# Altium schematic sheet MSP430F149.SCHDOC
size A4; Organization: UNSW Solar Racing Team; Address3: UNSW; Address4: Sydney NSW 2052; Address2: Electrical Engineering; Address1: Rm 109
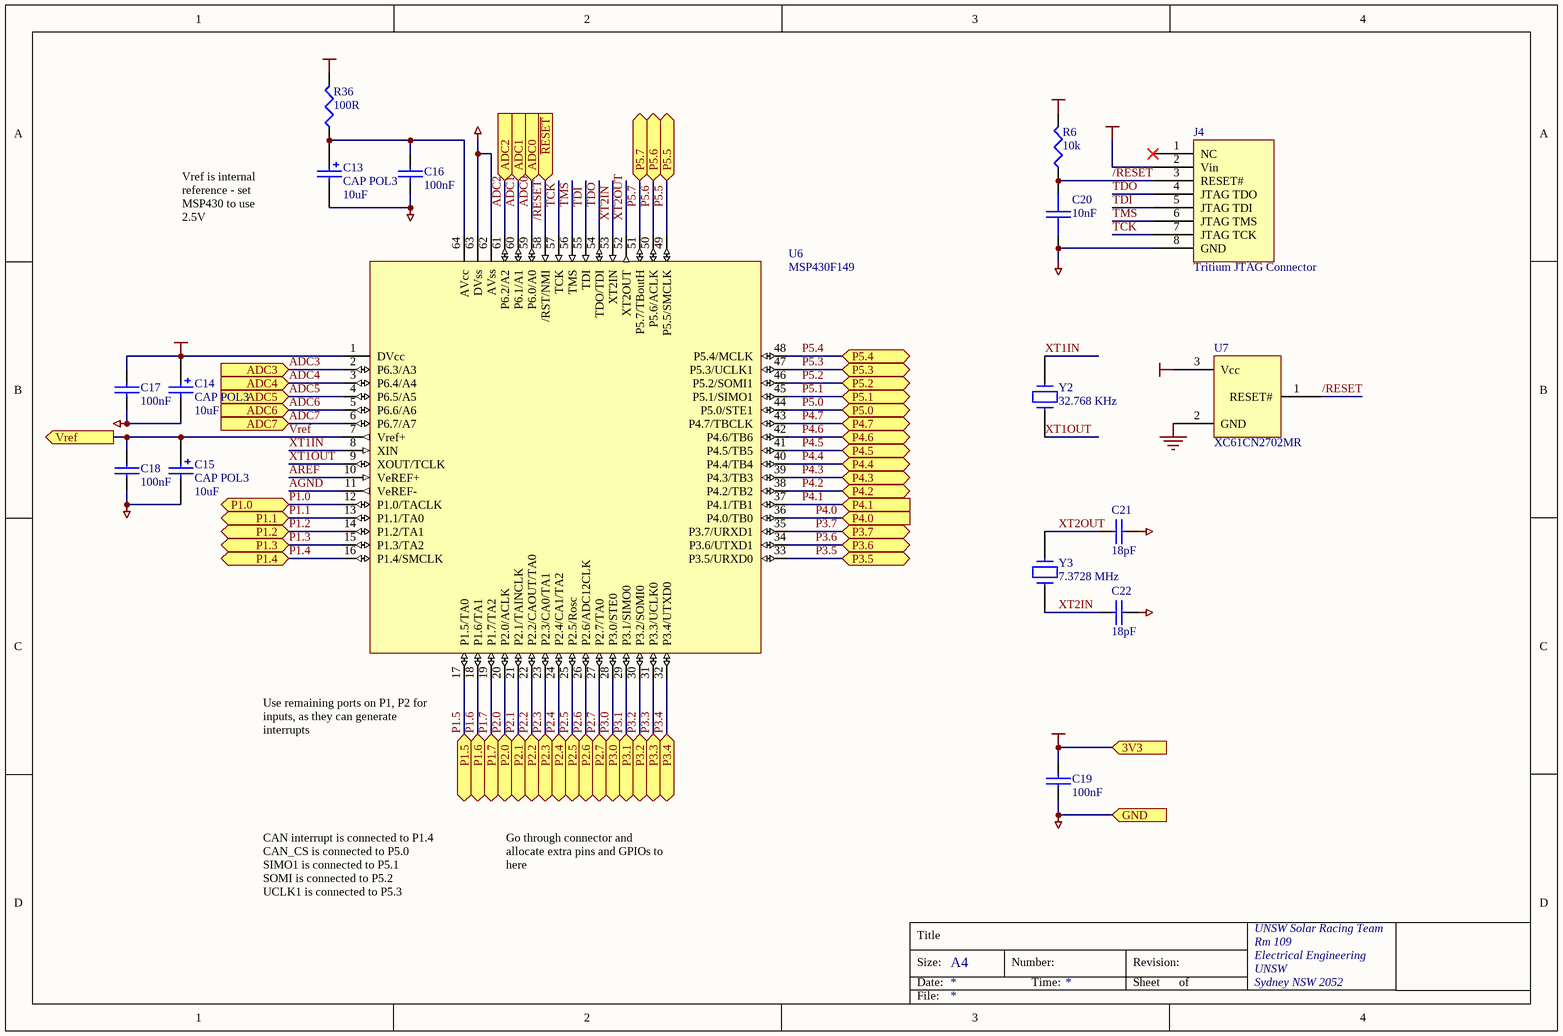
[diagram p0: MSP430F149.SCHDOC]

## Parts
C13  CAP POL3  value 10uF  [MCCT-CASEA]
C14  CAP POL3  value 10uF  [MCCT-CASEA]
C15  CAP POL3  value 10uF  [MCCT-CASEA]
C16  100nF  [0603]
C17  100nF  [0603]
C18  100nF  [0603]
C19  100nF  [0603]
C20  10nF  [0603]
C21  18pF  [0603]
C22  18pF  [0603]
J4  Tritium JTAG Connector  [HDR2X5]
R6  10k  [0603]
R36  100R  [0603]
U6  MSP430F149  [QFP64]
U7  XC61CN2702MR  [SOT23-3]
Y2  32.768 KHz  [WATCHA]
Y3  7.3728 MHz  [HC49/4H]

## Ports
3V3, ADC0 (in), ADC1 (in), ADC2 (in), ADC3 (in), ADC4 (in), ADC5 (in), ADC6 (in), ADC7 (in), GND, P1.0, P1.1, P1.2, P1.3, P1.4, P1.5, P1.6, P1.7, P2.0, P2.1, P2.2, P2.3, P2.4, P2.5, P2.6, P2.7, P3.0, P3.1, P3.2, P3.3, P3.4, P3.5, P3.6, P3.7, P4.0 (in), P4.1 (in), P4.2, P4.3, P4.4, P4.5, P4.6, P4.7, P5.0, P5.1, P5.2, P5.3, P5.4, P5.5, P5.6, P5.7, Vref (out), ~{RESET} (in)

## Nets
3V3: C14.1 C17.1 C19.1 J4.2(Vin) R6.2 R36.2 U6.1(DVcc) U7.3(Vcc) ; port 3V3
GND: C13.2 C14.2 C15.2 C16.2 C17.2 C18.2 C19.2 C20.2 C21.2 C22.2 J4.8(GND) U6.62(AVss) U6.63(DVss) U7.2(GND) ; port GND
/RESET: C20.1 J4.3(RESET#) R6.1 U6.58(/RST/NMI) U7.1(RESET#) ; port ~{RESET}
ADC0: U6.59(P6.0/A0) ; port ADC0
ADC1: U6.60(P6.1/A1) ; port ADC1
ADC2: U6.61(P6.2/A2) ; port ADC2
ADC3: U6.2(P6.3/A3) ; port ADC3
ADC4: U6.3(P6.4/A4) ; port ADC4
ADC5: U6.4(P6.5/A5) ; port ADC5
ADC6: U6.5(P6.6/A6) ; port ADC6
ADC7: U6.6(P6.7/A7) ; port ADC7
AGND: U6.11(VeREF-)
AREF: U6.10(VeREF+)
P1.0: U6.12(P1.0/TACLK) ; port P1.0
P1.1: U6.13(P1.1/TA0) ; port P1.1
P1.2: U6.14(P1.2/TA1) ; port P1.2
P1.3: U6.15(P1.3/TA2) ; port P1.3
P1.4: U6.16(P1.4/SMCLK) ; port P1.4
P1.5: U6.17(P1.5/TA0) ; port P1.5
P1.6: U6.18(P1.6/TA1) ; port P1.6
P1.7: U6.19(P1.7/TA2) ; port P1.7
P2.0: U6.20(P2.0/ACLK) ; port P2.0
P2.1: U6.21(P2.1/TAINCLK) ; port P2.1
P2.2: U6.22(P2.2/CAOUT/TA0) ; port P2.2
P2.3: U6.23(P2.3/CA0/TA1) ; port P2.3
P2.4: U6.24(P2.4/CA1/TA2) ; port P2.4
P2.5: U6.25(P2.5/Rosc) ; port P2.5
P2.6: U6.26(P2.6/ADC12CLK) ; port P2.6
P2.7: U6.27(P2.7/TA0) ; port P2.7
P3.0: U6.28(P3.0/STE0) ; port P3.0
P3.1: U6.29(P3.1/SIMO0) ; port P3.1
P3.2: U6.30(P3.2/SOMI0) ; port P3.2
P3.3: U6.31(P3.3/UCLK0) ; port P3.3
P3.4: U6.32(P3.4/UTXD0) ; port P3.4
P3.5: U6.33(P3.5/URXD0) ; port P3.5
P3.6: U6.34(P3.6/UTXD1) ; port P3.6
P3.7: U6.35(P3.7/URXD1) ; port P3.7
P4.0: U6.36(P4.0/TB0) ; port P4.0
P4.1: U6.37(P4.1/TB1) ; port P4.1
P4.2: U6.38(P4.2/TB2) ; port P4.2
P4.3: U6.39(P4.3/TB3) ; port P4.3
P4.4: U6.40(P4.4/TB4) ; port P4.4
P4.5: U6.41(P4.5/TB5) ; port P4.5
P4.6: U6.42(P4.6/TB6) ; port P4.6
P4.7: U6.43(P4.7/TBCLK) ; port P4.7
P5.0: U6.44(P5.0/STE1) ; port P5.0
P5.1: U6.45(P5.1/SIMO1) ; port P5.1
P5.2: U6.46(P5.2/SOMI1) ; port P5.2
P5.3: U6.47(P5.3/UCLK1) ; port P5.3
P5.4: U6.48(P5.4/MCLK) ; port P5.4
P5.5: U6.49(P5.5/SMCLK) ; port P5.5
P5.6: U6.50(P5.6/ACLK) ; port P5.6
P5.7: U6.51(P5.7/TBoutH) ; port P5.7
TCK: J4.7(JTAG_TCK) U6.57(TCK)
TDI: J4.5(JTAG_TDI) U6.55(TDI)
TDO: J4.4(JTAG_TDO) U6.54(TDO/TDI)
TMS: J4.6(JTAG_TMS) U6.56(TMS)
Vref: C15.1 C18.1 U6.7(Vref+) ; port Vref
XT1IN: U6.8(XIN) Y2.1
XT1OUT: U6.9(XOUT/TCLK) Y2.2
XT2IN: C22.1 U6.53(XT2IN) Y3.1
XT2OUT: C21.1 U6.52(XT2OUT) Y3.2
NetC13_1: C13.1 C16.1 R36.1 U6.64(AVcc)

Not connected (* = marked no-connect by the designer): J4 1(NC)*

## Notes on the sheet
- Vref is internal reference - set MSP430 to use 2.5V
- (near U6) Use remaining ports on P1, P2 for inputs, as they can generate interrupts
- CAN interrupt is connected to P1.4
  CAN_CS is connected to P5.0
  SIMO1 is connected to P5.1
  SOMI is connected to P5.2
  UCLK1 is connected to P5.3
- Go through connector and allocate extra pins and GPIOs to here
- Title
- Size:
- Date:
- A4
- Number:
- Time:
- Revision:
- Sheet
- of
- File:

## Library data of the parts
C13-C15 = CAP POL3: Polarized Capacitor (Surface Mount); Manufacturer: Generic Components; Class I: Passive; Published: 8-Jun-2000; Revision: July-2002: Re-released for DXP Platform.; Publisher: Altium Limited; Class II: Capacitor; Farnell: 967-014; Price: 1.06
C16-C22 = CAP: Capacitor
  C16-C19: Farnell: 753-567; Price: 0.30
  C20: Farnell: 722-236; Price: 0.11
  C21 C22: Farnell: 721-992; Price: 0.10
J4 = 430F_JTAG_TRITIUM: Tritium JTAG interface for MSP430; Extra parts: 672-520, 672-555; Farnell: 302-1439; Price: 2.19
R6 R36 = RES1: Resistor; Price: 0.11
  R6: Farnell: 612-601
  R36: Farnell: 612-364
U6 = MSP430F14X: Farnell: NA
U7 = XC61F: SOT23 reset generator; Farnell: 360-5504; Price: 1.80
Y2 Y3 = CRYSTAL
  Y2: Farnell: 569-914; Price: 2.22
  Y3: Farnell: 485-111; Price: 3.38